# Altium schematic sheet LiPo_Gas_Gauge.SchDoc: AusBubble : Power : LiPo Gas Gauge
size A4; DrawnBy: WR, ND; DocumentNumber: 3; Revision: A; SheetNumber: 3; SheetTotal: 4